# EAGLE schematic grue (EAGLE 8.6.0)
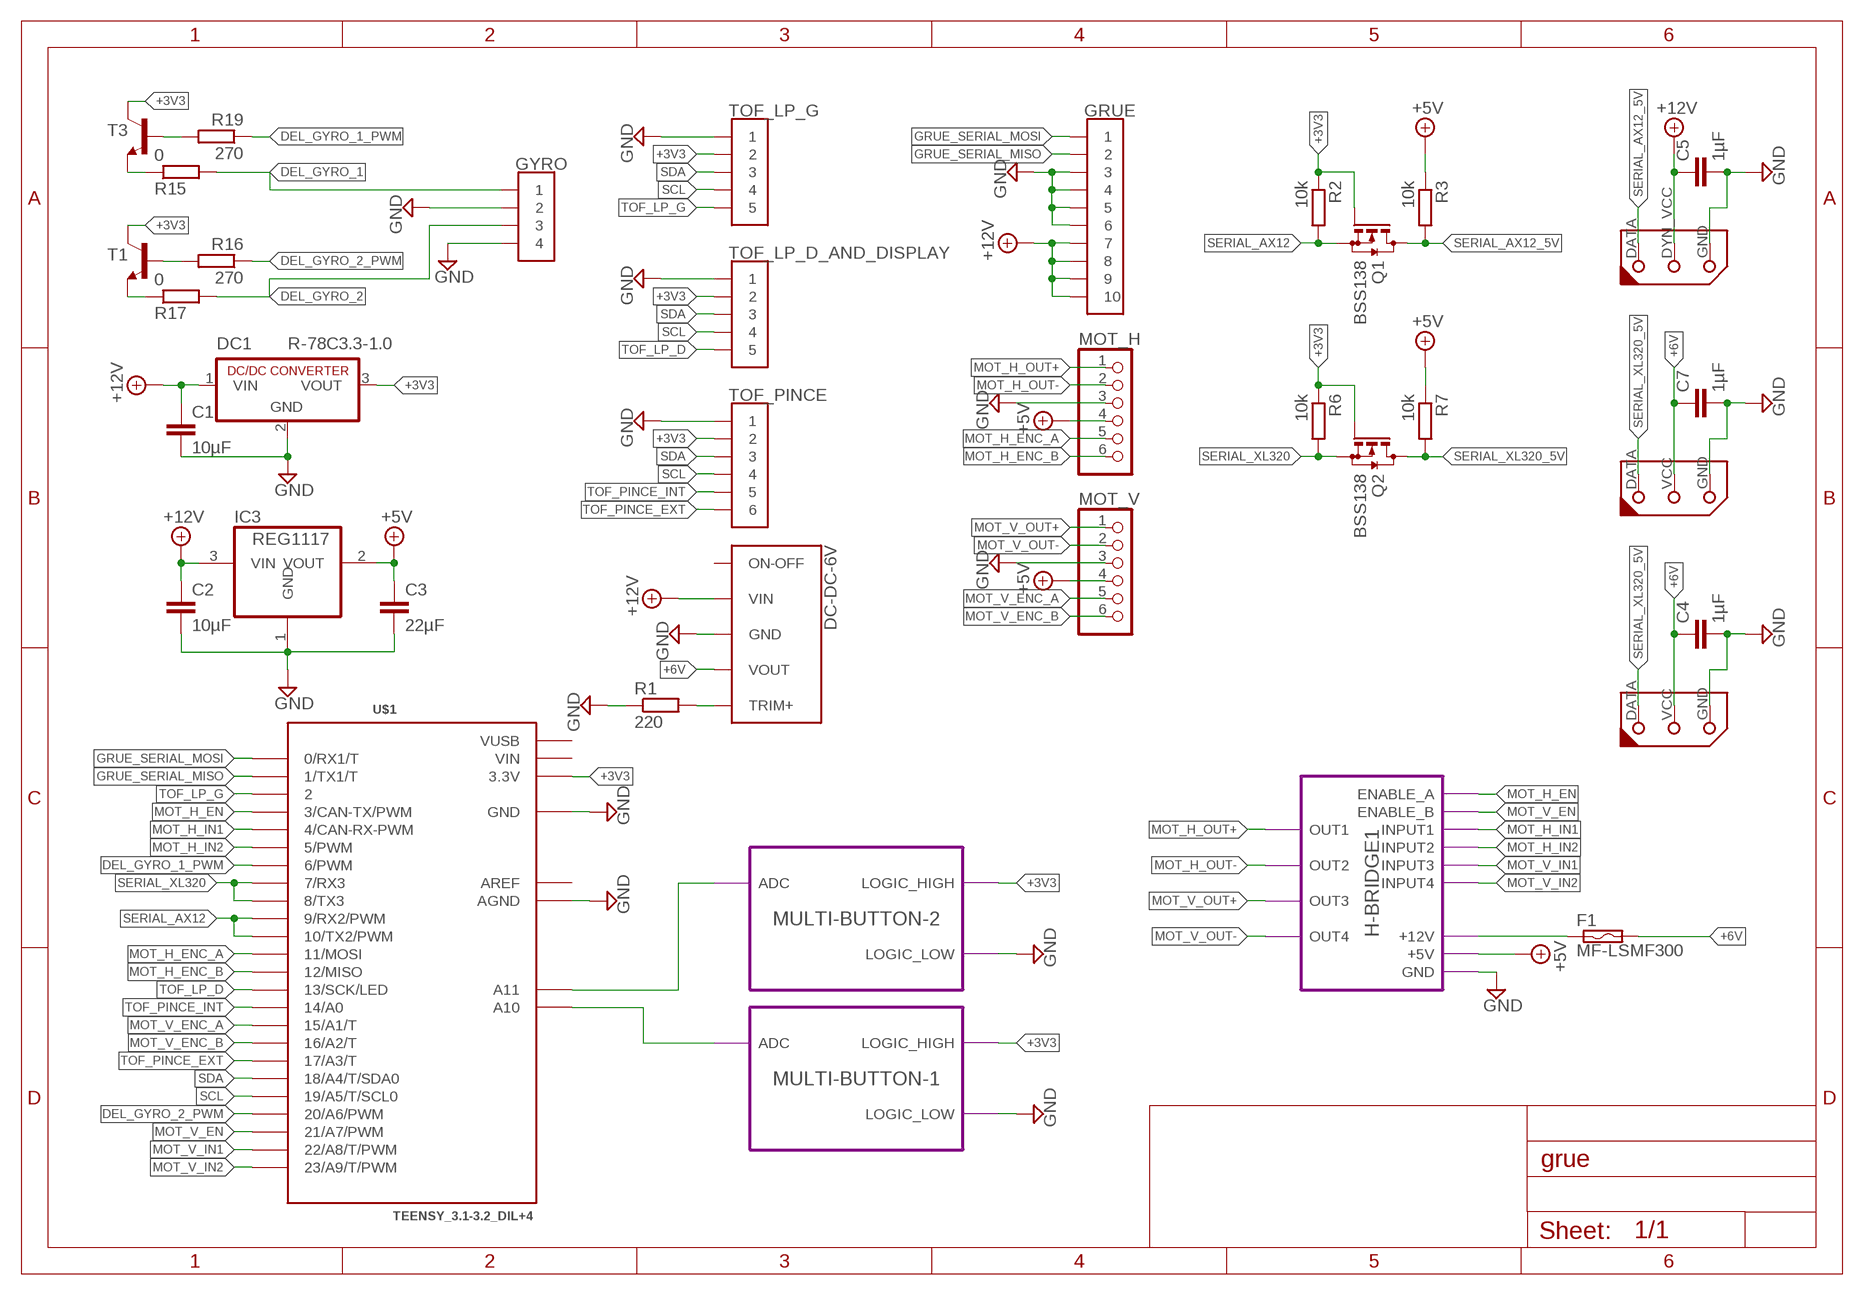
[diagram p0: schematic, sheet 1]

## Parts
AX12_G  DYNAMIXEL-1X03AX  [DYNAMIXEL_AX_1X03]
C1  10µF  C-EUC0805  [C0805]
C2  10µF  C-EUC0805  [C0805]
C3  22µF  C-EUC0805  [C0805]
C4  1µF  C-EUC0805  [C0805]
C5  1µF  C-EUC0805  [C0805]
C7  1µF  C-EUC0805  [C0805]
DC1  R-78C3.3-1.0  [SIP3]
DC-DC-6V  DC-DC-CONVERTER  [DC-DC-CONVERTER]
F1  MF-LSMF300  [MF-LSMF300]
GRUE  JST-10  [GH-10-V]
GYRO  JST-04GH-V  [GH-04-V]
IC3  REG1117  [SOT223]
MOT_H  PINHD-1X6  [1X06]
MOT_V  PINHD-1X6  [1X06]
Q1  BSS138  BSS123  [SOT23]
Q2  BSS138  BSS123  [SOT23]
R1  220  R-EU_R0805  [R0805]
R2  10k  R-EU_R0805  [R0805]
R3  10k  R-EU_R0805  [R0805]
R6  10k  R-EU_R0805  [R0805]
R7  10k  R-EU_R0805  [R0805]
R15  0  R-EU_R0805  [R0805]
R16  270  R-EU_R0805  [R0805]
R17  0  R-EU_R0805  [R0805]
R19  270  R-EU_R0805  [R0805]
T1  BC817-16-NPN-SOT23-BEC  [SOT23-BEC]
T3  BC817-16-NPN-SOT23-BEC  [SOT23-BEC]
TOF_LP_D_AND_DISPLAY  JST-05  [GH-05-V]
TOF_LP_G  JST-05  [GH-05-V]
TOF_PINCE  JST-06  [GH-06-V]
U$1  TEENSY_3.1-3.2_DIL+4  [TEENSY_3.0-3.2&LC_DIL+4]
XL320_G  DYNAMIXEL-1X03XL  [DYNAMIXEL_XL_1X03]
XL320_G1  DYNAMIXEL-1X03XL  [DYNAMIXEL_XL_1X03]

## Module instances
MULTI-BUTTON-1 = MULTI-BUTTON-ON-ADC
MULTI-BUTTON-2 = MULTI-BUTTON-ON-ADC
H-BRIDGE1 = H-BRIDGE

## Nets
+3V3: DC1.3(VOUT) Q1.1(G) Q2.1(G) R2.1 R6.1 T1.C T3.C TOF_LP_D_AND_DISPLAY.2 TOF_LP_G.2 TOF_PINCE.2 U$1.3.3V ; port MULTI-BUTTON-1.LOGIC_HIGH MULTI-BUTTON-2.LOGIC_HIGH
+5V: C3.1 IC3.2(VOUT) MOT_H.4 MOT_V.4 R3.1 R7.1 ; port H-BRIDGE1.+5V
+6V: C4.1 C7.1 DC-DC-6V.VOUT F1.2 XL320_G1.VCC(DYN_VCC) XL320_G.VCC(DYN_VCC)
+12V: AX12_G.DYN_VCC C1.1 C2.1 C5.1 DC1.1(VIN) DC-DC-6V.VIN GRUE.7 GRUE.8 GRUE.9 GRUE.10 IC3.3(VIN)
DEL_GYRO_1: GYRO.1 R15.2
DEL_GYRO_1_PWM: R19.1 U$1.6(6/PWM)
DEL_GYRO_2: GYRO.3 R17.2
DEL_GYRO_2_PWM: R16.1 U$1.20/A6(20/A6/PWM)
GND: AX12_G.GND C1.2 C2.2 C3.2 C4.2 C5.2 C7.2 DC1.2(GND) DC-DC-6V.GND GRUE.3 GRUE.4 GRUE.5 GRUE.6 GYRO.2 GYRO.4 IC3.1(GND) MOT_H.3 MOT_V.3 R1.1 TOF_LP_D_AND_DISPLAY.1 TOF_LP_G.1 TOF_PINCE.1 U$1.AGND U$1.GND XL320_G1.GND XL320_G.GND ; port MULTI-BUTTON-1.LOGIC_LOW MULTI-BUTTON-2.LOGIC_LOW H-BRIDGE1.GND
GRUE_SERIAL_MISO: GRUE.2 U$1.1(1/TX1/T)
GRUE_SERIAL_MOSI: GRUE.1 U$1.0(0/RX1/T)
MOT_H_EN: U$1.3(3/CAN-TX/PWM) ; port H-BRIDGE1.ENABLE_A
MOT_H_ENC_A: MOT_H.5 U$1.11(11/MOSI)
MOT_H_ENC_B: MOT_H.6 U$1.12(12/MISO)
MOT_H_IN1: U$1.4(4/CAN-RX-PWM) ; port H-BRIDGE1.INPUT1
MOT_H_IN2: U$1.5(5/PWM) ; port H-BRIDGE1.INPUT2
MOT_H_OUT+: MOT_H.1 ; port H-BRIDGE1.OUT1
MOT_H_OUT-: MOT_H.2 ; port H-BRIDGE1.OUT2
MOT_V_EN: U$1.21/A7(21/A7/PWM) ; port H-BRIDGE1.ENABLE_B
MOT_V_ENC_A: MOT_V.5 U$1.15/A1(15/A1/T)
MOT_V_ENC_B: MOT_V.6 U$1.16/A2(16/A2/T)
MOT_V_IN1: U$1.22/A8(22/A8/T/PWM) ; port H-BRIDGE1.INPUT3
MOT_V_IN2: U$1.23/A9(23/A9/T/PWM) ; port H-BRIDGE1.INPUT4
MOT_V_OUT+: MOT_V.1 ; port H-BRIDGE1.OUT3
MOT_V_OUT-: MOT_V.2 ; port H-BRIDGE1.OUT4
N$1: U$1.A10 ; port MULTI-BUTTON-1.ADC
N$2: U$1.A11 ; port MULTI-BUTTON-2.ADC
N$3: DC-DC-6V.TRIM+ R1.2
N$4: F1.1 ; port H-BRIDGE1.+12V
N$17: R15.1 T3.E
N$18: R19.2 T3.B
N$21: R17.1 T1.E
N$22: R16.2 T1.B
SCL: TOF_LP_D_AND_DISPLAY.4 TOF_LP_G.4 TOF_PINCE.4 U$1.19/A5(19/A5/T/SCL0)
SDA: TOF_LP_D_AND_DISPLAY.3 TOF_LP_G.3 TOF_PINCE.3 U$1.18/A4(18/A4/T/SDA0)
SERIAL_AX12: Q1.2(S) R2.2 U$1.9(9/RX2/PWM) U$1.10(10/TX2/PWM)
SERIAL_AX12_5V: AX12_G.DATA Q1.3(D) R3.2
SERIAL_XL320: Q2.2(S) R6.2 U$1.7(7/RX3) U$1.8(8/TX3)
SERIAL_XL320_5V: Q2.3(D) R7.2 XL320_G1.DATA XL320_G.DATA
TOF_LP_D: TOF_LP_D_AND_DISPLAY.5 U$1.13(13/SCK/LED)
TOF_LP_G: TOF_LP_G.5 U$1.2
TOF_PINCE_EXT: TOF_PINCE.6 U$1.17/A3(17/A3/T)
TOF_PINCE_INT: TOF_PINCE.5 U$1.14/A0
Unconnected: DC-DC-6V.ON-OFF

## Power pins joined to a net without a drawn wire
AREF: U$1.AREF
VIN: U$1.VIN
VUSB: U$1.VUSB

## Library data of the parts
AX12_G XL320_G XL320_G1 = 1NTech_pinhead:DYNAMIXEL-1X03
C1-C5 C7 = resistor:C-EU: CAPACITOR, European symbol
DC1 = dc-dc-converter:R-78C*-1.0: INNOLINE DC/DC-Converter 1.0 AMP SIP3 Single Output Source: Data sheet <http://www.mikrocontroller.net/attachment/150645/157764-da-01-en-DC_DC_WANDLER_R_78C5_0_1_0.pdf>
DC-DC-6V = dc-dc-converter-6v:DC-DC-CONVERTER; RS: 715-8575
F1 = polyswitch:MF-LSMF300: PolySwitch (TM) Resettable Device Source: Data sheet <http://www.farnell.com/datasheets/13482.pdf>; RS: 817-1652
GRUE = con-jst:JST-10
GYRO = con-jst:JST-04
IC3 = burr-brown:REG1117: 800mA and 1A Low Dropout (LDO) Positive Regulator 1.8V, 2.5V, 2.85V, 3.3V, 5V, and Adj; MPN: REG1117; OC_FARNELL: 1097566; OC_NEWARK: 14P6981; RS: 885-5432
MOT_H MOT_V = pinhead:PINHD-1X6: PIN HEADER
Q1 Q2 = transistor-small-signal:BSS123: N-CHANNEL MOS FET
R1-R3 R6 R7 R15-R17 R19 = resistor:R-EU_: RESISTOR, European symbol
T1 T3 = transistor:*-NPN-: NPN Transistror BF959 corrected 2008.03.06; RS: 781-4272
TOF_LP_D_AND_DISPLAY TOF_LP_G = con-jst:JST-05
TOF_PINCE = con-jst:JST-06
U$1 = Teensy_libSG:TEENSY_3.1-3.2_DIL+4: Teensy 3.1 and 3.2 in a DIL package with the inner 4 pins

## Module H-BRIDGE
Ports: ENABLE_A(io) ENABLE_B(io) INPUT1(io) INPUT2(io) INPUT3(io) INPUT4(io) GND(pwr) +5V(pwr) +12V(pwr) OUT1(io) OUT2(io) OUT3(io) OUT4(io)
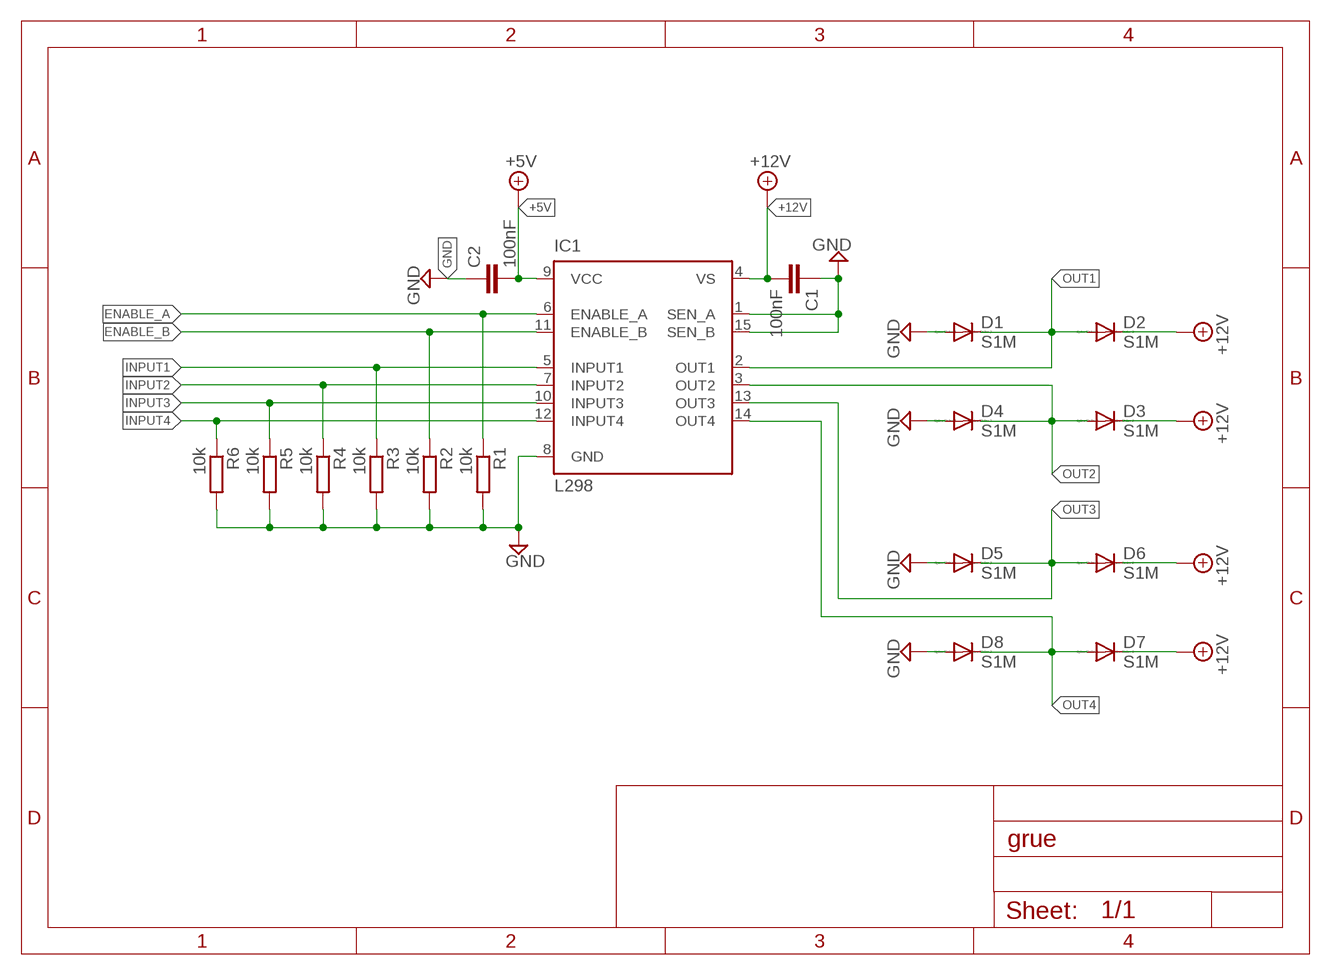
[diagram p1: schematic, module H-BRIDGE, sheet 1]

### Parts
C1  100nF  C-EUC0805  [C0805]
C2  100nF  C-EUC0805  [C0805]
D1  S1M  [SMA]
D2  S1M  [SMA]
D3  S1M  [SMA]
D4  S1M  [SMA]
D5  S1M  [SMA]
D6  S1M  [SMA]
D7  S1M  [SMA]
D8  S1M  [SMA]
IC1  L298  [MULTIWATT-15]
R1  10k  R-EU_R0805  [R0805]
R2  10k  R-EU_R0805  [R0805]
R3  10k  R-EU_R0805  [R0805]
R4  10k  R-EU_R0805  [R0805]
R5  10k  R-EU_R0805  [R0805]
R6  10k  R-EU_R0805  [R0805]

### Nets
+5V: C2.2 IC1.9(VCC)
+12V: C1.2 D2.C D3.C D6.C D7.C IC1.4(VS)
ENABLE_A: IC1.6(ENABLE_A) R1.1
ENABLE_B: IC1.11(ENABLE_B) R2.1
GND: C1.1 C2.1 D1.A D4.A D5.A D8.A IC1.1(SEN_A) IC1.8(GND) IC1.15(SEN_B) R1.2 R2.2 R3.2 R4.2 R5.2 R6.2
INPUT1: IC1.5(INPUT1) R3.1
INPUT2: IC1.7(INPUT2) R4.1
INPUT3: IC1.10(INPUT3) R5.1
INPUT4: IC1.12(INPUT4) R6.1
OUT1: D1.C D2.A IC1.2(OUT1)
OUT2: D3.A D4.C IC1.3(OUT2)
OUT3: D5.C D6.A IC1.13(OUT3)
OUT4: D7.A D8.C IC1.14(OUT4)

### Library data of the parts
C1 C2 = resistor:C-EU: CAPACITOR, European symbol
D1-D8 = diode:S1M; RS: 872-2874
IC1 = st-microelectronics:L298: DUAL FULL-BRIDGE DRIVER; MPN: L298N; OC_FARNELL: 1589425; OC_NEWARK: 32M1527
R1-R6 = resistor:R-EU_: RESISTOR, European symbol

## Module MULTI-BUTTON-ON-ADC
Ports: ADC(io) LOGIC_HIGH(io) LOGIC_LOW(io)
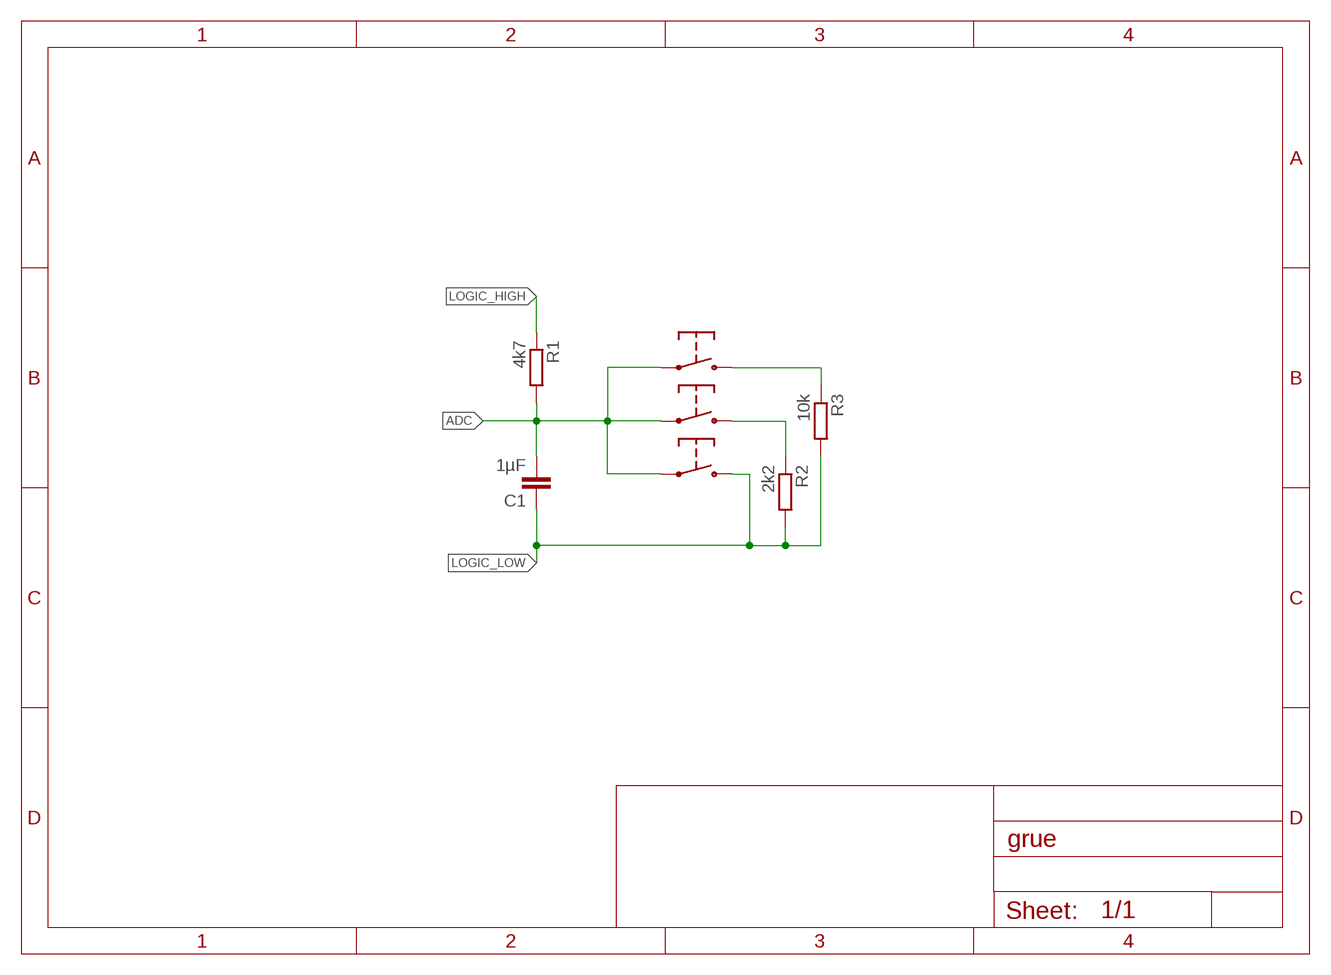
[diagram p2: schematic, module MULTI-BUTTON-ON-ADC, sheet 1]

### Parts
C1  1µF  C-EUC0805  [C0805]
R1  4k7  R-EU_R0805  [R0805]
R2  2k2  R-EU_R0805  [R0805]
R3  10k  R-EU_R0805  [R0805]
U1  PUSH-BUTTON  [PUSH-BUTTON]
U2  PUSH-BUTTON  [PUSH-BUTTON]
U3  PUSH-BUTTON  [PUSH-BUTTON]

### Nets
ADC: C1.2 R1.2 U1.1 U1.2 U2.1 U2.2 U3.1 U3.2
LOGIC_HIGH: R1.1
LOGIC_LOW: C1.1 R2.2 R3.2 U3.3 U3.4
N$3: R2.1 U2.3 U2.4
N$4: R3.1 U1.3 U1.4

### Library data of the parts
C1 = resistor:C-EU: CAPACITOR, European symbol
R1-R3 = resistor:R-EU_: RESISTOR, European symbol
U1-U3 = push-button:PUSH-BUTTON; H: 4.3mm; RS: 479-1491